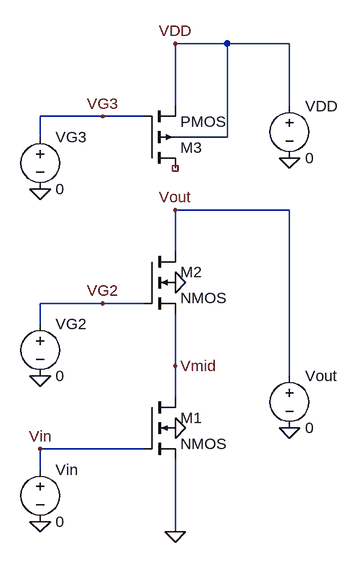
[diagram p0: schematic Chapter04C_01a.fig.asc]
Chapter04C_01a.fig.asc, the LTspice schematic file:
Version 4
SHEET 1 2940 740
WIRE 32 -640 -48 -640
WIRE 128 -640 32 -640
WIRE -48 -544 -48 -640
WIRE 128 -544 128 -640
WIRE -160 -528 -256 -528
WIRE -96 -528 -160 -528
WIRE -256 -496 -256 -528
WIRE 32 -496 32 -640
WIRE 32 -496 -48 -496
WIRE 128 -384 -48 -384
WIRE -48 -320 -48 -384
WIRE -160 -240 -256 -240
WIRE -96 -240 -160 -240
WIRE -256 -208 -256 -240
WIRE -48 -144 -48 -224
WIRE 128 -128 128 -384
WIRE -48 -96 -48 -144
WIRE -96 -16 -256 -16
WIRE -256 16 -256 -16
WIRE -48 112 -48 0
FLAG 128 -464 0
FLAG -48 112 0
FLAG -256 96 0
FLAG -48 -640 VDD
FLAG -256 -16 Vin
FLAG -256 -416 0
FLAG -160 -528 VG3
FLAG -48 -272 0
FLAG -48 -48 0
FLAG -256 -128 0
FLAG -160 -240 VG2
FLAG -48 -144 Vmid
FLAG -48 -384 Vout
FLAG 128 -48 0
SYMBOL nmos4 -96 -96 R0
SYMATTR InstName M1
SYMBOL pmos4 -96 -448 M180
SYMATTR InstName M3
SYMBOL voltage 128 -560 R0
SYMATTR InstName VDD
SYMATTR Value 0
SYMBOL voltage -256 0 R0
WINDOW 123 0 0 Left 0
WINDOW 39 0 0 Left 0
SYMATTR InstName Vin
SYMATTR Value 0
SYMBOL voltage -256 -512 R0
SYMATTR InstName VG3
SYMATTR Value 0
SYMBOL nmos4 -96 -320 R0
SYMATTR InstName M2
SYMBOL voltage -256 -224 R0
SYMATTR InstName VG2
SYMATTR Value 0
SYMBOL voltage 128 -144 R0
SYMATTR InstName Vout
SYMATTR Value 0

The netlist it stands for:
* Chapter04C_01a.fig.asc
M1 Vmid Vin 0 0 NMOS
M3 NC_01 VG3 VDD VDD PMOS
VDD VDD 0 0
Vin Vin 0 0
VG3 VG3 0 0
M2 Vout VG2 Vmid 0 NMOS
VG2 VG2 0 0
Vout Vout 0 0
.model NMOS NMOS
.model PMOS PMOS
.lib standard.mos
.backanno
.end